# Altium project PCB_Project1.PrjPCB
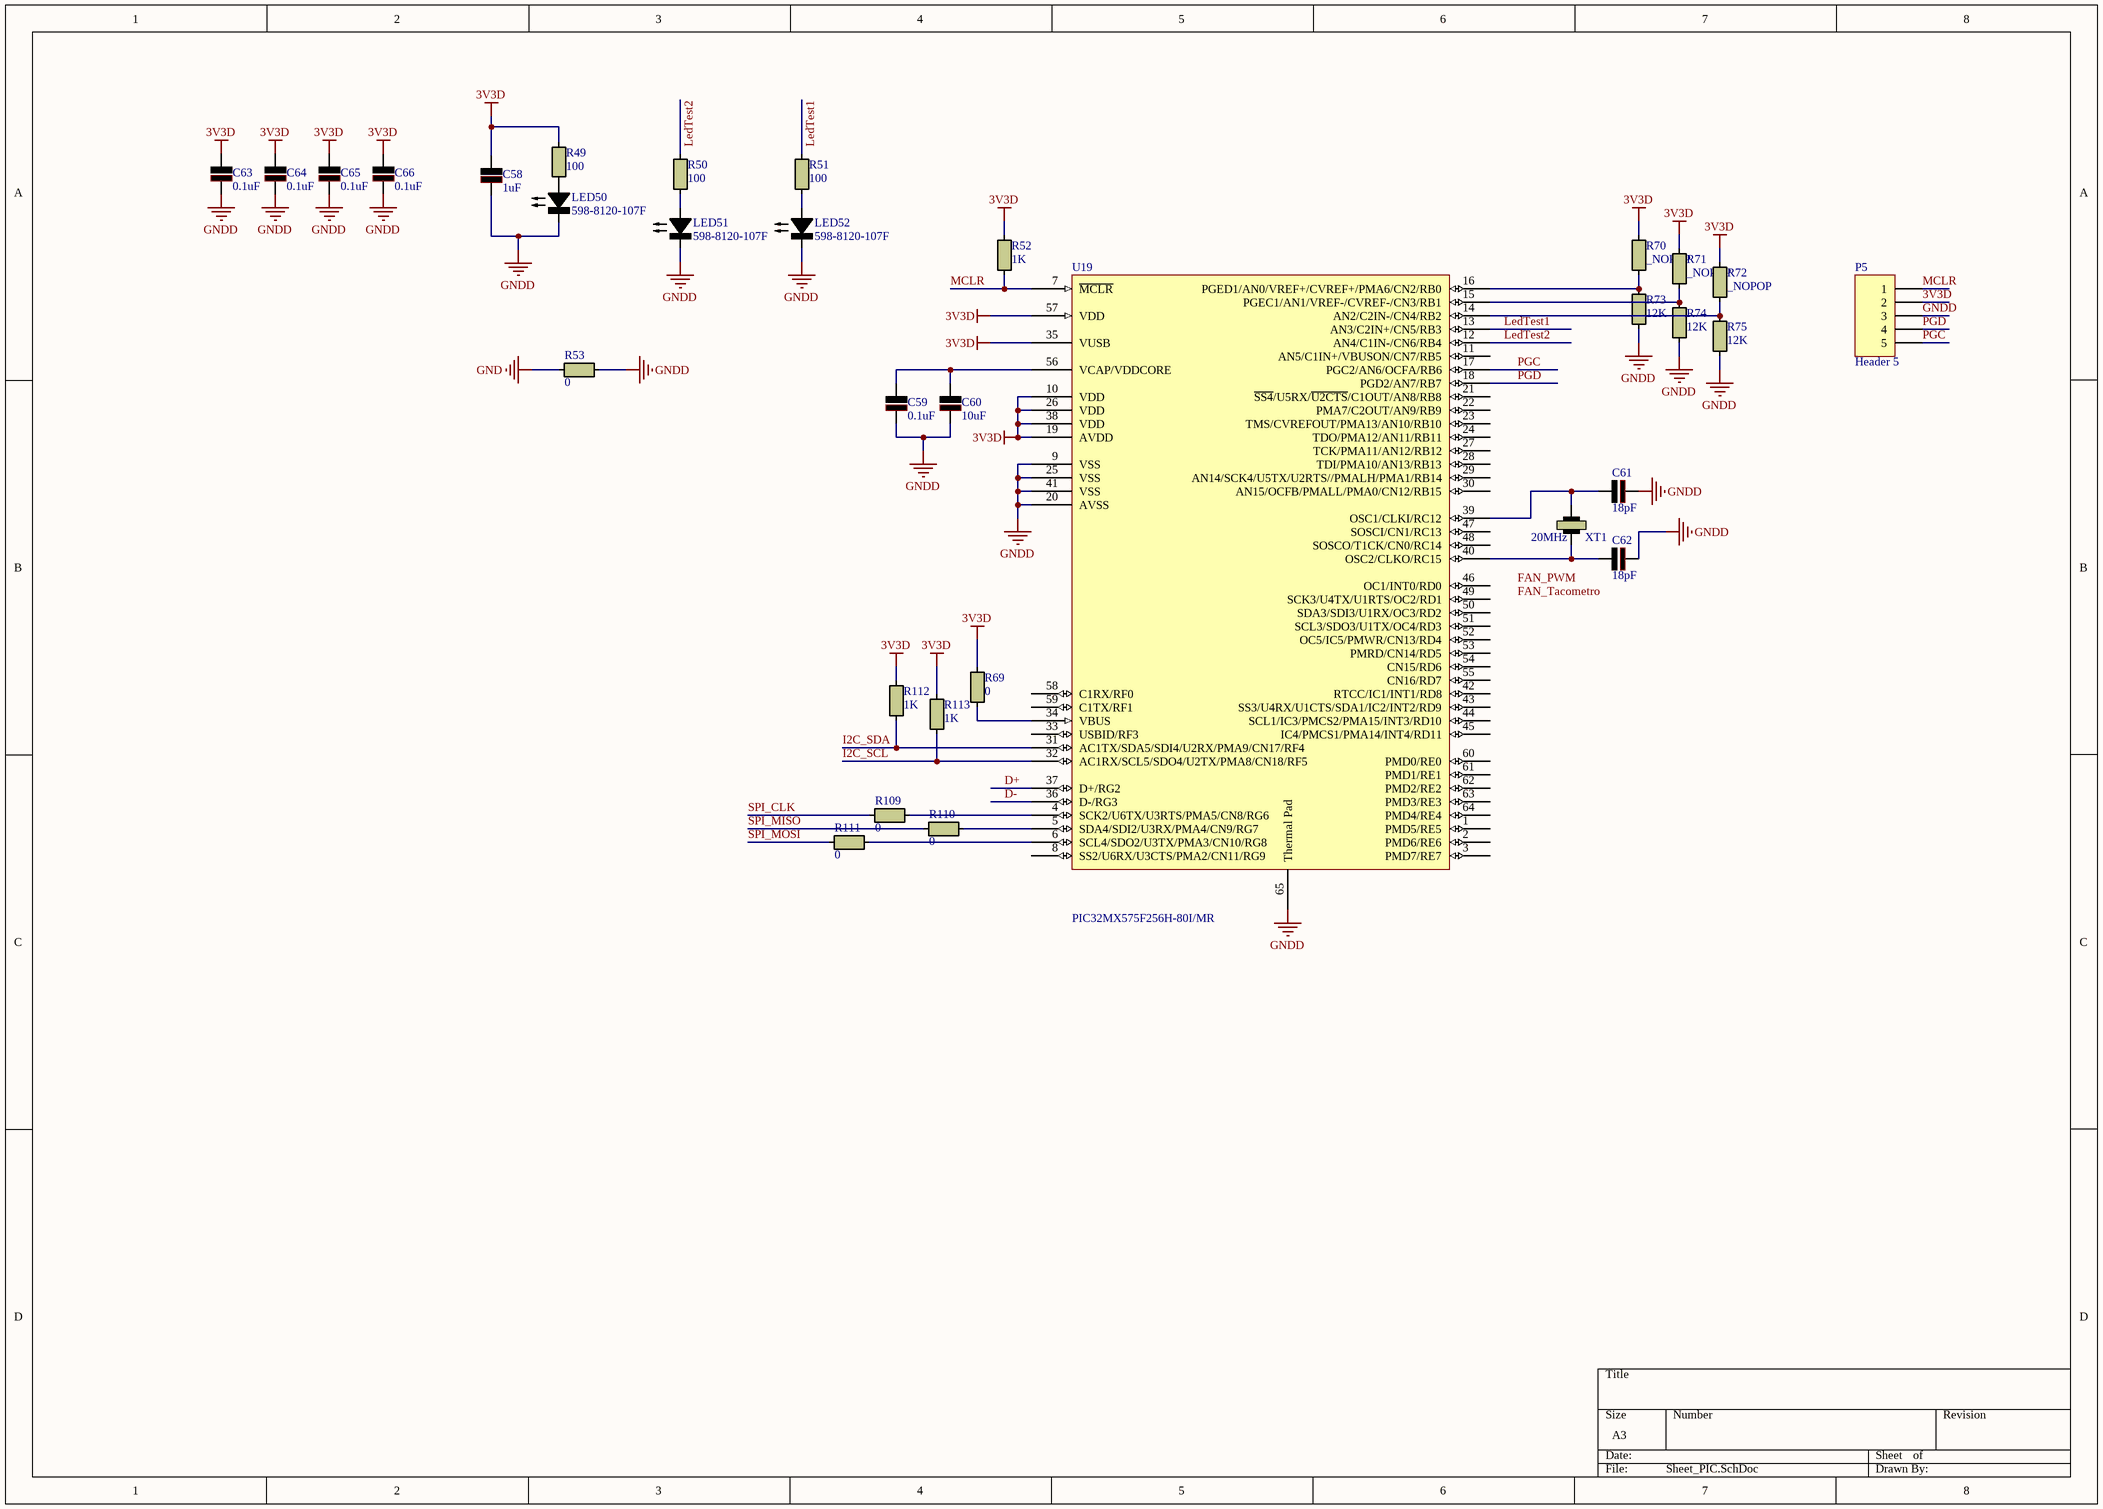
[diagram p0: Sheet_PIC.SchDoc]
2 sheets, 68 parts. Net scope: global (net labels, ports and power ports of the same name join across sheets).
Sheets:
  Sheet_PIC.SchDoc
  Sheet_ALI.SchDoc

## Sheet Sheet_PIC.SchDoc
size A3

### Parts
C58  1uF  [C_0805]
C59  0.1uF  [C_0402]
C60  10uF  [C_0805]
C61  18pF  [C_0402]
C62  18pF  [C_0402]
C63  0.1uF  [C_0402]
C64  0.1uF  [C_0402]
C65  0.1uF  [C_0402]
C66  0.1uF  [C_0402]
LED50  598-8120-107F  [LED_0805]
LED51  598-8120-107F  [LED_0805]
LED52  598-8120-107F  [LED_0805]
P5  Header 5  [header5_molex_53398_1.25_vertical]
R49  100  [R_0402]
R50  100  [R_0402]
R51  100  [R_0402]
R52  1K  [R_0402]
R53  0  [R_0805]
R69  0  [R_0402]
R70  _NOPOP  [R_0402]
R71  _NOPOP  [R_0402]
R72  _NOPOP  [R_0402]
R73  12K  [R_0402]
R74  12K  [R_0402]
R75  12K  [R_0402]
R109  0  [R_0402]
R110  0  [R_0402]
R111  0  [R_0402]
R112  1K  [R_0402]
R113  1K  [R_0402]
U19  PIC32MX575F256H-80I/MR
XT1  20MHz  [XTAL_ABM7]

### Nets
3V3D: C58.1 C63.1 C64.1 C65.1 C66.1 P5.2 R49.2 R52.1 R69.2 R70.1 R71.1 R72.1 R112.2 R113.2 U19.10(VDD) U19.19(AVDD) U19.26(VDD) U19.35(VUSB) U19.38(VDD) U19.57(VDD)
GND: R53.1
GNDD: C58.2 C59.2 C60.2 C61.2 C62.2 C63.2 C64.2 C65.2 C66.2 LED50.K LED51.K LED52.K P5.3 R53.2 R73.2 R74.2 R75.2 U19.9(VSS) U19.20(AVSS) U19.25(VSS) U19.41(VSS) U19.65(Thermal_Pad)
D+: U19.37(D+/RG2)
D-: U19.36(D-/RG3)
I2C_SCL: R113.1 U19.32(AC1RX/SCL5/SDO4/U2TX/PMA8/CN18/RF5)
I2C_SDA: R112.1 U19.31(AC1TX/SDA5/SDI4/U2RX/PMA9/CN17/RF4)
LedTest1: R51.2 U19.13(AN3/C2IN+/CN5/RB3)
LedTest2: R50.2 U19.12(AN4/C1IN-/CN6/RB4)
MCLR: P5.1 R52.2 U19.7(~{MCLR})
PGC: P5.5 U19.17(PGC2/AN6/OCFA/RB6)
PGD: P5.4 U19.18(PGD2/AN7/RB7)
SPI_CLK: R109.1
SPI_MISO: R110.1
SPI_MOSI: R111.1
NetC59_1: C59.1 C60.1 U19.56(VCAP/VDDCORE)
NetC61_1: C61.1 U19.39(OSC1/CLKI/RC12) XT1.2
NetC62_1: C62.1 U19.40(OSC2/CLKO/RC15) XT1.1
NetLED50_A: LED50.A R49.1
NetLED51_A: LED51.A R50.1
NetLED52_A: LED52.A R51.1
NetR69_1: R69.1 U19.34(VBUS)
NetR70_2: R70.2 R73.1 U19.16(PGED1/AN0/VREF+/CVREF+/PMA6/CN2/RB0)
NetR71_2: R71.2 R74.1 U19.15(PGEC1/AN1/VREF-/CVREF-/CN3/RB1)
NetR72_2: R72.2 R75.1 U19.14(AN2/C2IN-/CN4/RB2)
NetR109_2: R109.2 U19.4(SCK2/U6TX/U3RTS/PMA5/CN8/RG6)
NetR110_2: R110.2 U19.5(SDA4/SDI2/U3RX/PMA4/CN9/RG7)
NetR111_2: R111.2 U19.6(SCL4/SDO2/U3TX/PMA3/CN10/RG8)

Not connected (* = marked no-connect by the designer): U19 1(PMD5/RE5) 2(PMD6/RE6) 3(PMD7/RE7) 8(SS2/U6RX/U3CTS/PMA2/CN11/RG9) 11(AN5/C1IN+/VBUSON/CN7/RB5) 21(~{SS4}/U5RX/~{U2CTS}/C1OUT/AN8/RB8) 22(PMA7/C2OUT/AN9/RB9) 23(TMS/CVREFOUT/PMA13/AN10/RB10) 24(TDO/PMA12/AN11/RB11) 27(TCK/PMA11/AN12/RB12) 28(TDI/PMA10/AN13/RB13) 29(AN14/SCK4/U5TX/U2RTS//PMALH/PMA1/RB14) 30(AN15/OCFB/PMALL/PMA0/CN12/RB15) 33(USBID/RF3) 42(RTCC/IC1/INT1/RD8) 43(SS3/U4RX/U1CTS/SDA1/IC2/INT2/RD9) 44(SCL1/IC3/PMCS2/PMA15/INT3/RD10) 45(IC4/PMCS1/PMA14/INT4/RD11) 46(OC1/INT0/RD0) 47(SOSCI/CN1/RC13) 48(SOSCO/T1CK/CN0/RC14) 49(SCK3/U4TX/U1RTS/OC2/RD1) 50(SDA3/SDI3/U1RX/OC3/RD2) 51(SCL3/SDO3/U1TX/OC4/RD3) 52(OC5/IC5/PMWR/CN13/RD4) 53(PMRD/CN14/RD5) 54(CN15/RD6) 55(CN16/RD7) 58(C1RX/RF0) 59(C1TX/RF1) 60(PMD0/RE0) 61(PMD1/RE1) 62(PMD2/RE2) 63(PMD3/RE3) 64(PMD4/RE4)

### Notes on the sheet
- Labels drawn without touching a wire or pin: FAN_PWM, FAN_Tacometro

### Library data of the parts
C58-C66 = C: Precio: 0,553; Código Mouser: 647-UCL1E331MNL1GS
LED50-LED52 = LED: Precio: 0,099; Código Mouser: 859-LTST-S220EKT
P5 = Header 5: Header, 5-Pin; LatestRevisionDate: 17-Jul-2002; LatestRevisionNote: Re-released for DXP Platform.; Publisher: Altium Limited
R49-R53 R69-R75 R109-R113 = R: Precio: 0,05; Código Mouser: Variable
U19 = PIC32MX575F256H-80I/PT
XT1 = XTAL: Precio: 0,285; Código Mouser: 815-ABLS-4.0M-T

## Sheet Sheet_ALI.SchDoc
size A3
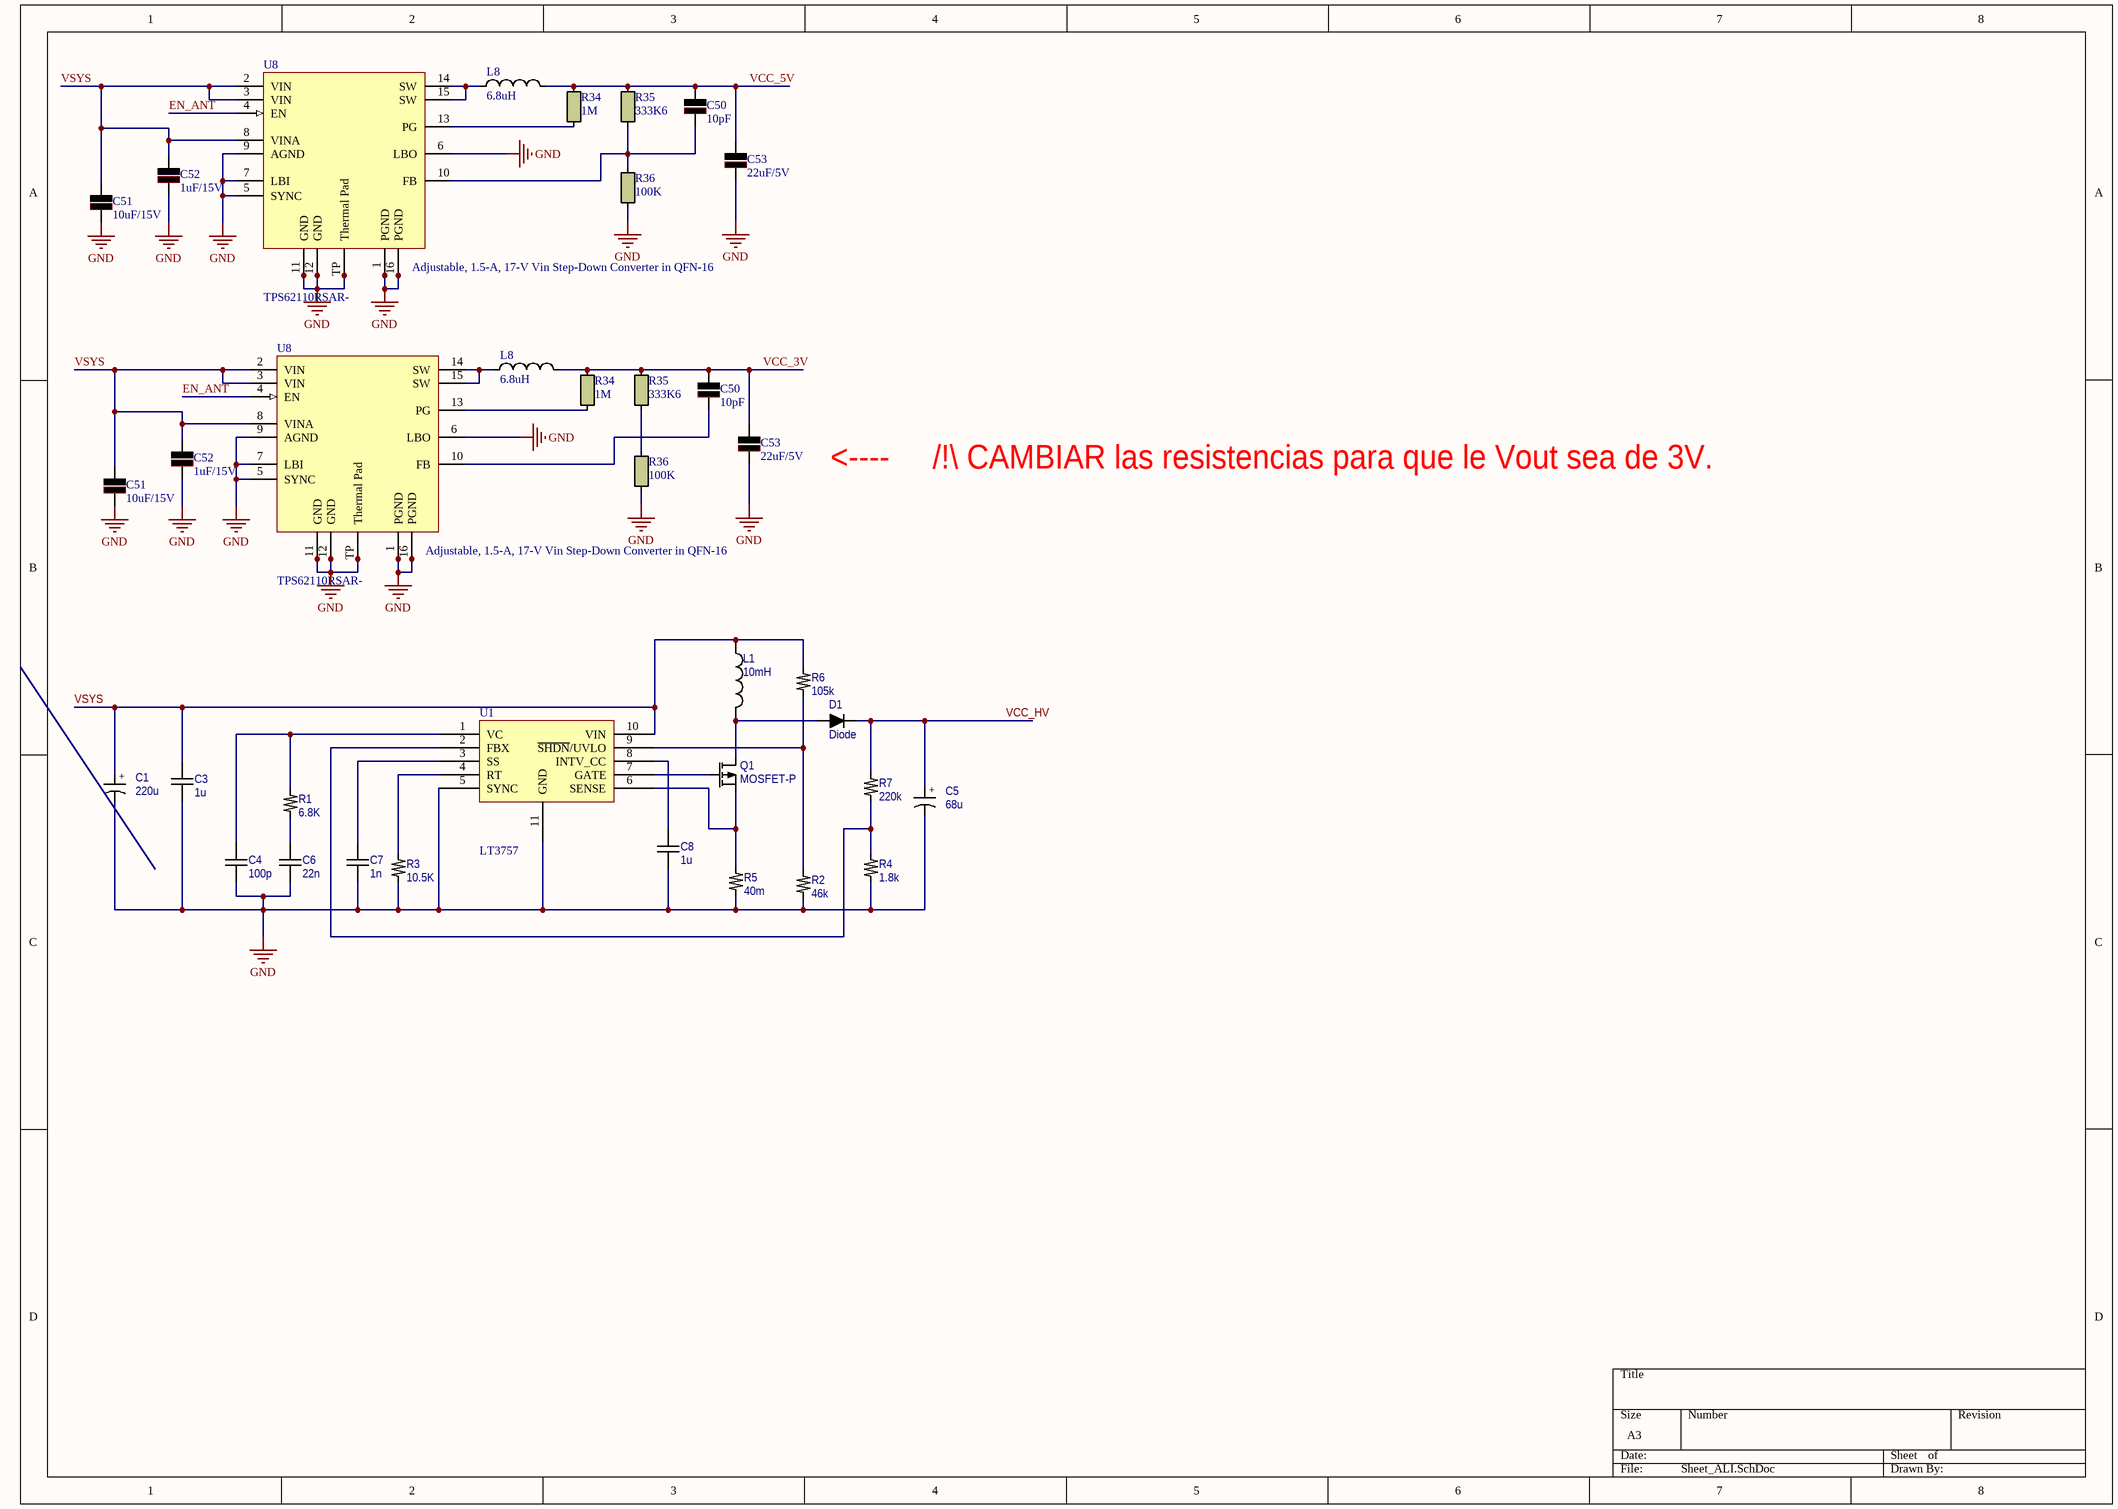
[diagram p1: Sheet_ALI.SchDoc]

### Parts
(Parts that share a designator on the sheet are numbered #1, #2 ... from top to bottom, then left to right.)
C1  220u  [C_SMD_D10H10]
C3  1u  [C_0805]
C4  100p  [C_0805]
C5  68u  [C_D18H25]
C6  22n  [C_0805]
C7  1n  [C_0805]
C8  1u  [C_0805]
C50#1  10pF  [C_0402]
C50#2  10pF  [C_0402]
C51#1  10uF/15V  [C_0805]
C51#2  10uF/15V  [C_0805]
C52#1  1uF/15V  [C_0805]
C52#2  1uF/15V  [C_0805]
C53#1  22uF/5V  [C_0805]
C53#2  22uF/5V  [C_0805]
D1  Diode  [D_PowerDI5]
L1  10mH  [L_NS10155]
L8#1  6.8uH  [L_TDK_SLF_6.8u]
L8#2  6.8uH  [L_TDK_SLF_6.8u]
Q1  MOSFET-P  [D2PAk]
R1  6.8K  [R_0805]
R2  46k  [R_0805]
R3  10.5K  [R_0805]
R4  1.8k  [C_1206]
R5  40m  [C_1206]
R6  105k  [R_0805]
R7  220k  [R_2010]
R34#1  1M  [R_0402]
R34#2  1M  [R_0402]
R35#1  333K6  [R_0402]
R35#2  333K6  [R_0402]
R36#1  100K  [R_0402]
R36#2  100K  [R_0402]
U1  LT3757  [MSOP10+1]
U8#1  Adjustable, 1.5-A, 17-V Vin Step-Down Converter in QFN-16  Part Number: TPS62110RSAR-  [TPS62110]
U8#2  Adjustable, 1.5-A, 17-V Vin Step-Down Converter in QFN-16  Part Number: TPS62110RSAR-  [TPS62110]

### Nets
GND: C1.1 C3.1 C4.1 C5.1 C6.1 C7.1 C8.1 C51#1.2 C51#2.2 C52#1.2 C52#2.2 C53#1.2 C53#2.2 R2.1 R3.1 R4.1 R5.1 R36#1.1 R36#2.1 U1.5(SYNC) U1.11(GND) U8#1.1(PGND) U8#1.5(SYNC) U8#1.6(LBO) U8#1.7(LBI) U8#1.9(AGND) U8#1.11(GND) U8#1.12(GND) U8#1.16(PGND) U8#1.TP(Thermal_Pad) U8#2.1(PGND) U8#2.5(SYNC) U8#2.6(LBO) U8#2.7(LBI) U8#2.9(AGND) U8#2.11(GND) U8#2.12(GND) U8#2.16(PGND) U8#2.TP(Thermal_Pad)
EN_ANT: U8#1.4(EN) U8#2.4(EN)
VCC_3V: C50#2.1 C53#2.1 L8#2.2 R34#2.2 R35#2.2
VCC_5V: C50#1.1 C53#1.1 L8#1.2 R34#1.2 R35#1.2
VCC_HV: C5.2 D1.3 R7.2
VSYS: C1.2 C3.2 C51#1.1 C51#2.1 C52#1.1 C52#2.1 L1.1 R6.2 U1.10(VIN) U8#1.2(VIN) U8#1.3(VIN) U8#1.8(VINA) U8#2.2(VIN) U8#2.3(VIN) U8#2.8(VINA)
NetC4_2: C4.2 R1.2 U1.1(VC)
NetC6_2: C6.2 R1.1
NetC7_2: C7.2 U1.3(SS)
NetC8_2: C8.2 U1.8(INTV_CC)
NetC50#1_2: C50#1.2 R35#1.1 R36#1.2 U8#1.10(FB)
NetC50#2_2: C50#2.2 U8#2.10(FB)
NetD1_1: D1.1 L1.2 Q1.2(D)
NetL8#1_1: L8#1.1 U8#1.14(SW) U8#1.15(SW)
NetL8#2_1: L8#2.1 U8#2.14(SW) U8#2.15(SW)
NetQ1_1: Q1.1(G) U1.7(GATE)
NetQ1_3: Q1.3(S) R5.2 U1.6(SENSE)
NetR2_2: R2.2 R6.1 U1.9(~{SHDN}/UVLO)
NetR3_2: R3.2 U1.4(RT)
NetR4_2: R4.2 R7.1 U1.2(FBX)
NetR34#1_1: R34#1.1 U8#1.13(PG)
NetR34#2_1: R34#2.1 U8#2.13(PG)
NetR35#2_1: R35#2.1 R36#2.2

### Notes on the sheet
- <----     /!\ CAMBIAR las resistencias para que le Vout sea de 3V.
- (in symbol Cap_Pol) +

### Library data of the parts
C1 C5 = Cap_Pol: Capacitor; Value: 100pF; Published: 8-Jun-2000; LatestRevisionDate: 17-Jul-2002; LatestRevisionNote: Re-released for DXP Platform.; PackageReference: RAD-0.3; Publisher: Altium Limited
C3 C4 C6-C8 = Cap: Capacitor; Value: 100pF; Published: 8-Jun-2000; LatestRevisionDate: 17-Jul-2002; LatestRevisionNote: Re-released for DXP Platform.; PackageReference: RAD-0.3; Publisher: Altium Limited
C50#1 C50#2 C51#1 C51#2 C52#1 C52#2 C53#1 C53#2 = C: Precio: 0,553; Código Mouser: 647-UCL1E331MNL1GS
L1 = Inductor: Code_IEC: 1005; Published: 8-Jun-2000; LatestRevisionDate: 29-May-2009; LatestRevisionNote: IPC-7351 Footprint Added.; PackageReference: 0402-A; Publisher: Altium Limited; PackageDescription: Chip Inductor; Code_JEITA: 0402; Value: 10mH
L8#1 L8#2 = L: Precio: 0,59; Código Mouser: 652-SDR1005-331KL
Q1 = MOSFET-P: P-Channel MOSFET; Published: 8-Jun-2000; LatestRevisionDate: 17-Jul-2002; LatestRevisionNote: Re-released for DXP Platform.; PackageVersion: 1995/1996; PackageReference: E3; Publisher: Altium Limited; PackageDescription: TO, Flat Index; 3 In-Line, Axial Leads; Body Dia. 4.6mm; Lead Dia. 0.5 mm (max)
R1-R7 = Res: Resistor; Value: 1K; Published: 8-Jun-2000; LatestRevisionDate: 29-May-2009; LatestRevisionNote: IPC-7351 Footprint Added.; PackageReference: J1-0603; Publisher: Altium Limited; PackageDescription: Chip Resistor
R34#1 R34#2 R35#1 R35#2 R36#1 R36#2 = R: Precio: 0,05; Código Mouser: Variable
U8#1 U8#2 = TPS62110: Supplier 1: Digi-Key; Supplier Part Number 1: 296-24839-1-ND
D1 = Diode: Published: 8-Jun-2000; LatestRevisionDate: 17-Jul-2002; LatestRevisionNote: Re-released for DXP Platform.; DatasheetVersion: 1998; PackageVersion: Aug-1999; PackageReference: DO-41; Publisher: Altium Limited; PackageDescription: Diode, Axial; Body 5.2 x 2.7 mm (LxDia. max), Lead Dia. 0.86 mm (max); Code_JEDEC: DO-204-AL; ComponentLink1Description: Manufacturer Link; ComponentLink1URL: http://www.fairchildsemi.com/; ComponentLink2Description: Datasheet; ComponentLink2URL: http://www.fairchildsemi.com/ds/1N%2F1N4001.pdf

## Nets that join several sheets
GND: Sheet_PIC (R53.1), Sheet_ALI (39 pins)